# EAGLE design POWER_DISTRO (EAGLE 5.06)
SHT_NAME: POWER INPUT; VOLTAGE: 36V

## Sheet 1 of 4
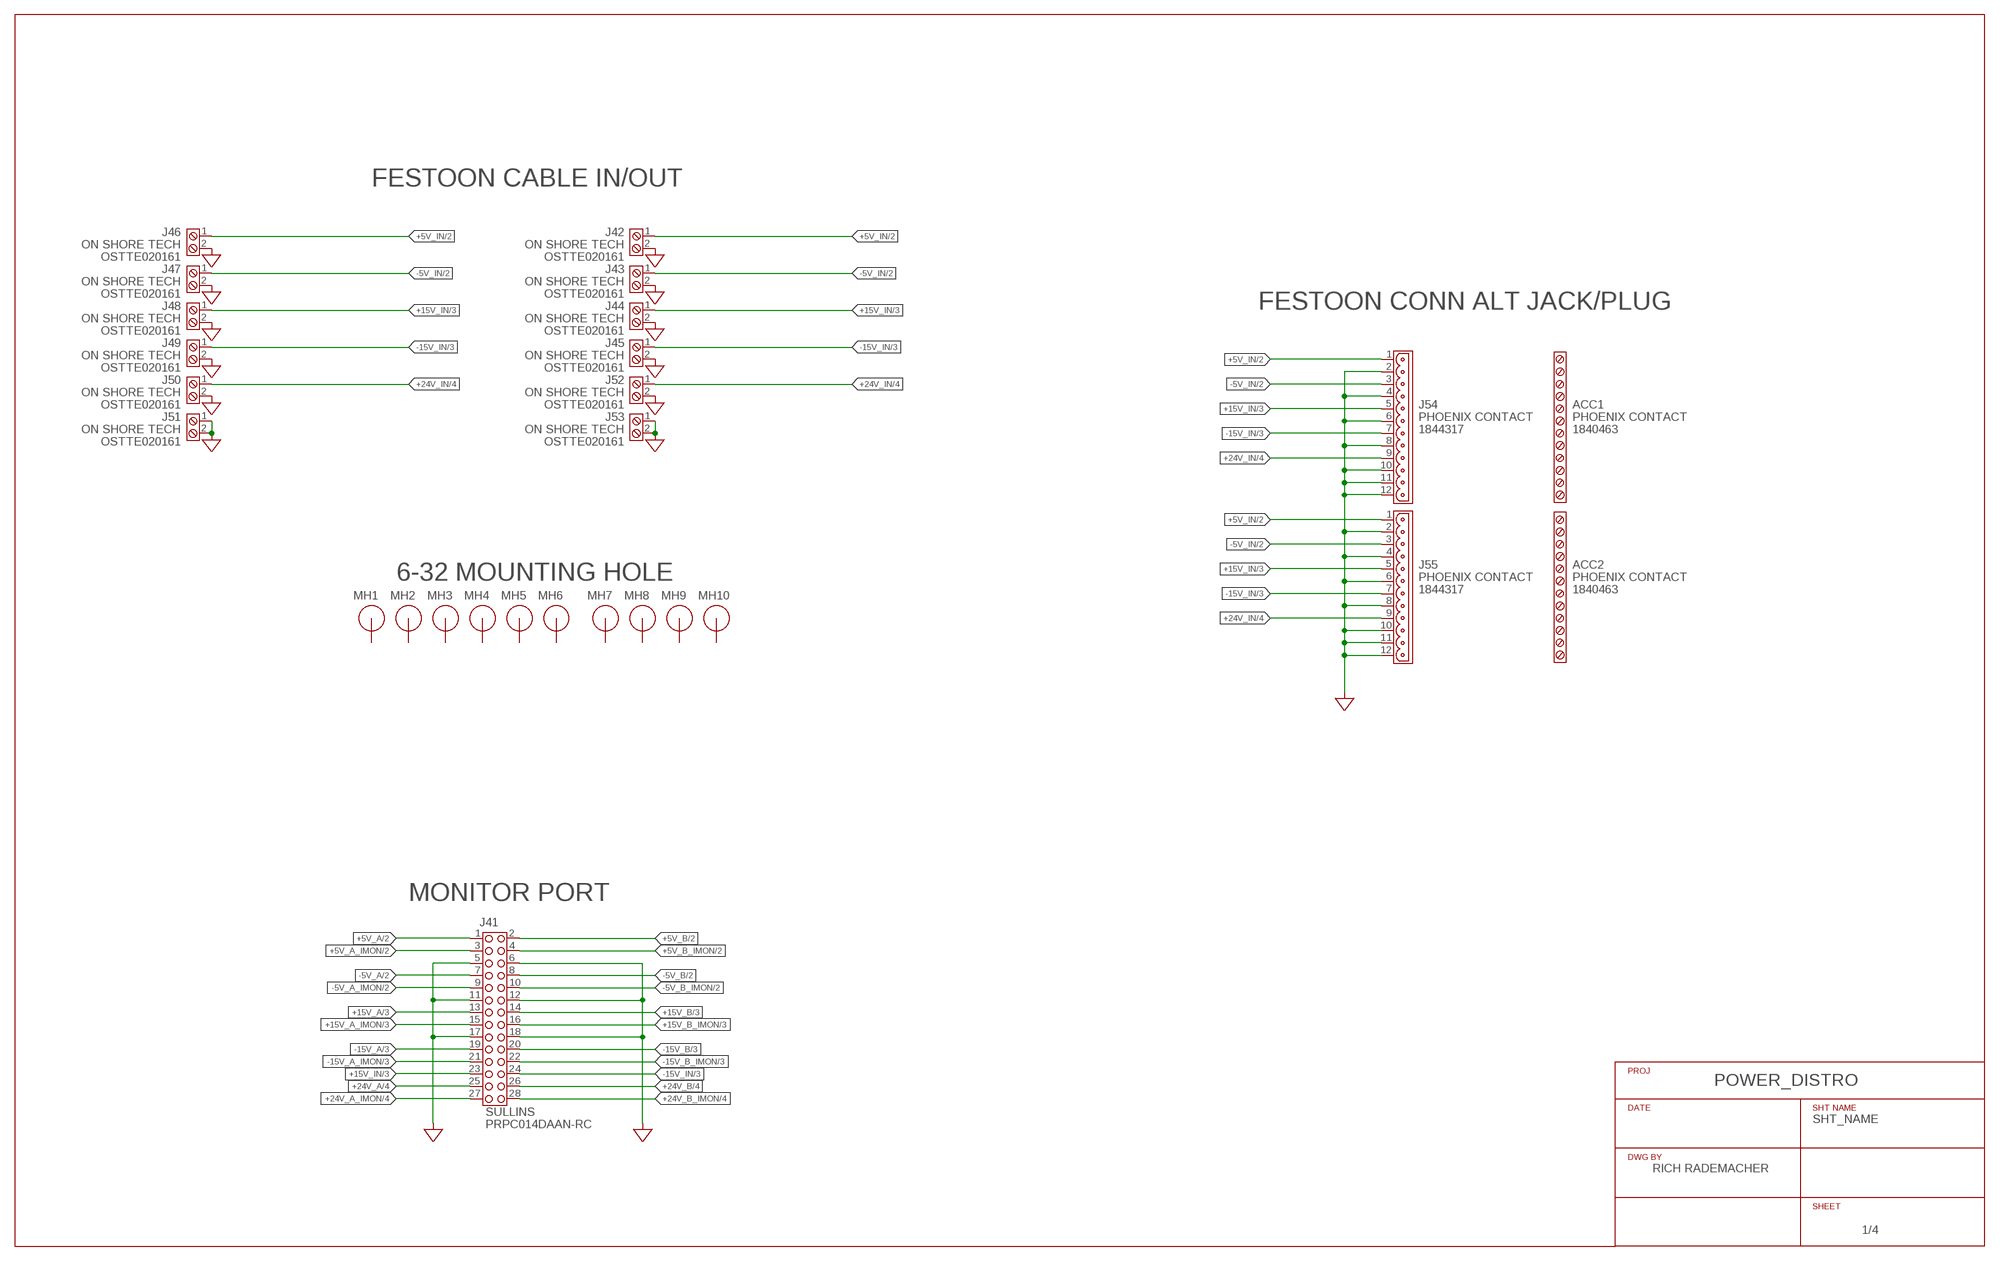
[diagram p0: schematic, sheet 1]
ACC1 (ACC_SCREWTERM_3.5_12POS_PLUG): MFG: PHOENIX CONTACT; MPN: 1840463; PRICE: 19.85; VENDOR: DIGIKEY; VPN: 277-5740-ND
ACC2 (ACC_SCREWTERM_3.5_12POS_PLUG): MFG: PHOENIX CONTACT; MPN: 1840463; PRICE: 19.85; VENDOR: DIGIKEY; VPN: 277-5740-ND
U$4 (TITLEBLOCK): AUTHOR: RICH RADEMACHER; DO_NOT_BOM: TRUE; SHT_NAME: SHT_NAME

### Parts
J41  HDR_2X14X100  [2X14X0.100_HDR]
J42  CONN_SCREWTERM_3.5MM_2POS  [OST_SCREWTERM_3.5MM_2POS]
J43  CONN_SCREWTERM_3.5MM_2POS  [OST_SCREWTERM_3.5MM_2POS]
J44  CONN_SCREWTERM_3.5MM_2POS  [OST_SCREWTERM_3.5MM_2POS]
J45  CONN_SCREWTERM_3.5MM_2POS  [OST_SCREWTERM_3.5MM_2POS]
J46  CONN_SCREWTERM_3.5MM_2POS  [OST_SCREWTERM_3.5MM_2POS]
J47  CONN_SCREWTERM_3.5MM_2POS  [OST_SCREWTERM_3.5MM_2POS]
J48  CONN_SCREWTERM_3.5MM_2POS  [OST_SCREWTERM_3.5MM_2POS]
J49  CONN_SCREWTERM_3.5MM_2POS  [OST_SCREWTERM_3.5MM_2POS]
J50  CONN_SCREWTERM_3.5MM_2POS  [OST_SCREWTERM_3.5MM_2POS]
J51  CONN_SCREWTERM_3.5MM_2POS  [OST_SCREWTERM_3.5MM_2POS]
J52  CONN_SCREWTERM_3.5MM_2POS  [OST_SCREWTERM_3.5MM_2POS]
J53  CONN_SCREWTERM_3.5MM_2POS  [OST_SCREWTERM_3.5MM_2POS]
J54  CONN_SCREWTERM_3.5MM_12POS_RECEPT  [PHOENIX_1844317]
J55  CONN_SCREWTERM_3.5MM_12POS_RECEPT  [PHOENIX_1844317]
MH1  MTG-HOLE-6-32  [MTG-6-32]
MH2  MTG-HOLE-6-32  [MTG-6-32]
MH3  MTG-HOLE-6-32  [MTG-6-32]
MH4  MTG-HOLE-6-32  [MTG-6-32]
MH5  MTG-HOLE-6-32  [MTG-6-32]
MH6  MTG-HOLE-6-32  [MTG-6-32]
MH7  MTG-HOLE-6-32  [MTG-6-32]
MH8  MTG-HOLE-6-32  [MTG-6-32]
MH9  MTG-HOLE-6-32  [MTG-6-32]
MH10  MTG-HOLE-6-32  [MTG-6-32]

### Nets
+5V_A: J41.1 ; also sheet 2
+5V_A_IMON: J41.3 ; also sheet 2
+5V_B: J41.2 ; also sheet 2
+5V_B_IMON: J41.4 ; also sheet 2
+5V_IN: J42.1 J46.1 J54.1 J55.1 ; also sheet 2
+15V_A: J41.13 ; also sheet 3
+15V_A_IMON: J41.15 ; also sheet 3
+15V_B: J41.14 ; also sheet 3
+15V_B_IMON: J41.16 ; also sheet 3
+15V_IN: J41.23 J44.1 J48.1 J54.5 J55.5 ; also sheet 3
+24V_A: J41.25 ; also sheet 4
+24V_A_IMON: J41.27 ; also sheet 4
+24V_B: J41.26 ; also sheet 4
+24V_B_IMON: J41.28 ; also sheet 4
+24V_IN: J50.1 J52.1 J54.9 J55.9 ; also sheet 4
-5V_A: J41.7 ; also sheet 2
-5V_A_IMON: J41.9 ; also sheet 2
-5V_B: J41.8 ; also sheet 2
-5V_B_IMON: J41.10 ; also sheet 2
-5V_IN: J43.1 J47.1 J54.3 J55.3 ; also sheet 2
-15V_A: J41.19 ; also sheet 3
-15V_A_IMON: J41.21 ; also sheet 3
-15V_B: J41.20 ; also sheet 3
-15V_B_IMON: J41.22 ; also sheet 3
-15V_IN: J41.24 J45.1 J49.1 J54.7 J55.7 ; also sheet 3
AGND: J41.5 J41.6 J41.11 J41.12 J41.17 J41.18 J42.2 J43.2 J44.2 J45.2 J46.2 J47.2 J48.2 J49.2 J50.2 J51.1 J51.2 J52.2 J53.1 J53.2 J54.2 J54.4 J54.6 J54.8 J54.10 J54.11 J54.12 J55.2 J55.4 J55.6 J55.8 J55.10 J55.11 J55.12 ; also sheet 2,3,4
Unconnected: MH1.1 MH2.1 MH3.1 MH4.1 MH5.1 MH6.1 MH7.1 MH8.1 MH9.1 MH10.1

### Notes on the sheet
- FESTOON CABLE IN/OUT
- FESTOON CONN ALT JACK/PLUG
- 6-32 MOUNTING HOLE
- MONITOR PORT

## Sheet 2 of 4
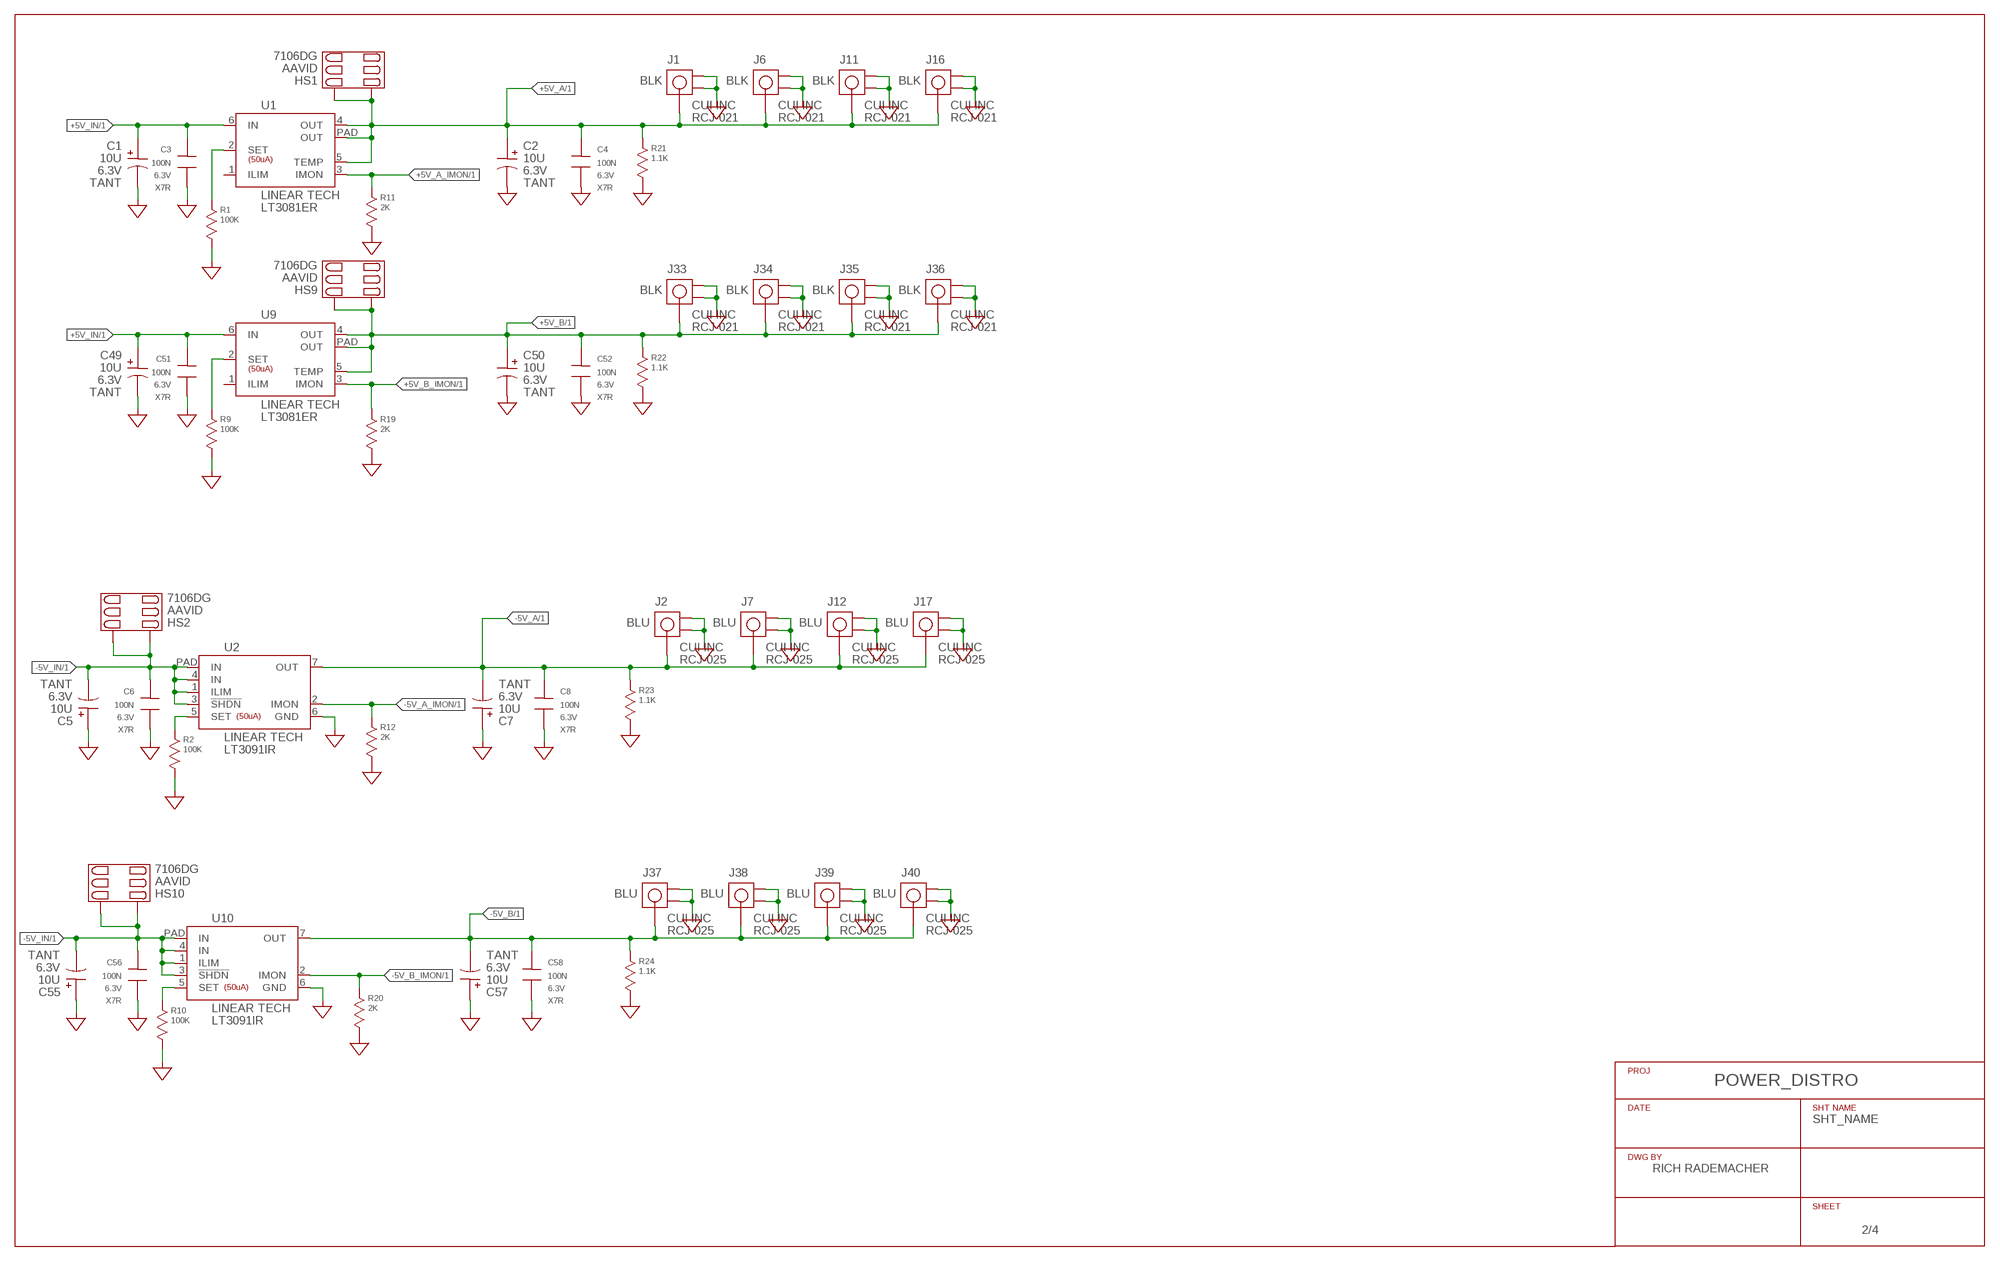
[diagram p1: schematic, sheet 2]
U$1 (TITLEBLOCK): AUTHOR: RICH RADEMACHER; DO_NOT_BOM: TRUE; SHT_NAME: SHT_NAME

### Parts
C1  10U  CAP-POL-SIZED  [CAP-SIZE_D/E_EIA7343]
C2  10U  CAP-POL-SIZED  [CAP-SIZE_D/E_EIA7343]
C3  100N  CAP-NP-0805  [R-0805]
C4  100N  CAP-NP-0805  [R-0805]
C5  10U  CAP-POL-SIZED  [CAP-SIZE_D/E_EIA7343]
C6  100N  CAP-NP-0805  [R-0805]
C7  10U  CAP-POL-SIZED  [CAP-SIZE_D/E_EIA7343]
C8  100N  CAP-NP-0805  [R-0805]
C49  10U  CAP-POL-SIZED  [CAP-SIZE_D/E_EIA7343]
C50  10U  CAP-POL-SIZED  [CAP-SIZE_D/E_EIA7343]
C51  100N  CAP-NP-0805  [R-0805]
C52  100N  CAP-NP-0805  [R-0805]
C55  10U  CAP-POL-SIZED  [CAP-SIZE_D/E_EIA7343]
C56  100N  CAP-NP-0805  [R-0805]
C57  10U  CAP-POL-SIZED  [CAP-SIZE_D/E_EIA7343]
C58  100N  CAP-NP-0805  [R-0805]
HS1  HEATSINK_AAVID_7106  [AAVID_7106]
HS2  HEATSINK_AAVID_7106  [AAVID_7106]
HS9  HEATSINK_AAVID_7106  [AAVID_7106]
HS10  HEATSINK_AAVID_7106  [AAVID_7106]
J1  CONN_RCA  CONN_RCA-BLACK-BLK  [CUI_RCJ-02X]
J2  CONN_RCA  CONN_RCA-BLU-BLK  [CUI_RCJ-02X]
J6  CONN_RCA  CONN_RCA-BLACK-BLK  [CUI_RCJ-02X]
J7  CONN_RCA  CONN_RCA-BLU-BLK  [CUI_RCJ-02X]
J11  CONN_RCA  CONN_RCA-BLACK-BLK  [CUI_RCJ-02X]
J12  CONN_RCA  CONN_RCA-BLU-BLK  [CUI_RCJ-02X]
J16  CONN_RCA  CONN_RCA-BLACK-BLK  [CUI_RCJ-02X]
J17  CONN_RCA  CONN_RCA-BLU-BLK  [CUI_RCJ-02X]
J33  CONN_RCA  CONN_RCA-BLACK-BLK  [CUI_RCJ-02X]
J34  CONN_RCA  CONN_RCA-BLACK-BLK  [CUI_RCJ-02X]
J35  CONN_RCA  CONN_RCA-BLACK-BLK  [CUI_RCJ-02X]
J36  CONN_RCA  CONN_RCA-BLACK-BLK  [CUI_RCJ-02X]
J37  CONN_RCA  CONN_RCA-BLU-BLK  [CUI_RCJ-02X]
J38  CONN_RCA  CONN_RCA-BLU-BLK  [CUI_RCJ-02X]
J39  CONN_RCA  CONN_RCA-BLU-BLK  [CUI_RCJ-02X]
J40  CONN_RCA  CONN_RCA-BLU-BLK  [CUI_RCJ-02X]
R1  100K  RESISTOR-0805  [R-0805]
R2  100K  RESISTOR-0805  [R-0805]
R9  100K  RESISTOR-0805  [R-0805]
R10  100K  RESISTOR-0805  [R-0805]
R11  2K  RESISTOR-0805  [R-0805]
R12  2K  RESISTOR-0805  [R-0805]
R19  2K  RESISTOR-0805  [R-0805]
R20  2K  RESISTOR-0805  [R-0805]
R21  1.1K  RESISTOR-0805  [R-0805]
R22  1.1K  RESISTOR-0805  [R-0805]
R23  1.1K  RESISTOR-0805  [R-0805]
R24  1.1K  RESISTOR-0805  [R-0805]
U1  REG_LT3081  [DD-7_LINEARTECH]
U2  REG_LT3091  [DD-7_LINEARTECH]
U9  REG_LT3081  [DD-7_LINEARTECH]
U10  REG_LT3091  [DD-7_LINEARTECH]

### Nets
+5V_A: C2.+ C4.A HS1.L HS1.R J1.PIN J6.PIN J11.PIN J16.PIN R21.A U1.4(OUT) U1.5(TEMP) U1.PAD(OUT) ; also sheet 1
+5V_A_IMON: R11.A U1.3(IMON) ; also sheet 1
+5V_B: C50.+ C52.A HS9.L HS9.R J33.PIN J34.PIN J35.PIN J36.PIN R22.A U9.4(OUT) U9.5(TEMP) U9.PAD(OUT) ; also sheet 1
+5V_B_IMON: R19.A U9.3(IMON) ; also sheet 1
+5V_IN: C1.+ C3.A C49.+ C51.A U1.6(IN) U9.6(IN) ; also sheet 1
-5V_A: C7.- C8.A J2.PIN J7.PIN J12.PIN J17.PIN R23.A U2.7(OUT) ; also sheet 1
-5V_A_IMON: R12.A U2.2(IMON) ; also sheet 1
-5V_B: C57.- C58.A J37.PIN J38.PIN J39.PIN J40.PIN R24.A U10.7(OUT) ; also sheet 1
-5V_B_IMON: R20.A U10.2(IMON) ; also sheet 1
-5V_IN: C5.- C6.A C55.- C56.A HS2.L HS2.R HS10.L HS10.R U2.1(ILIM) U2.3(!SHDN) U2.4(IN) U2.PAD(IN) U10.1(ILIM) U10.3(!SHDN) U10.4(IN) U10.PAD(IN) ; also sheet 1
AGND: C1.- C2.- C3.B C4.B C5.+ C6.B C7.+ C8.B C49.- C50.- C51.B C52.B C55.+ C56.B C57.+ C58.B J1.GND@1 J1.GND@2 J2.GND@1 J2.GND@2 J6.GND@1 J6.GND@2 J7.GND@1 J7.GND@2 J11.GND@1 J11.GND@2 J12.GND@1 J12.GND@2 J16.GND@1 J16.GND@2 J17.GND@1 J17.GND@2 J33.GND@1 J33.GND@2 J34.GND@1 J34.GND@2 J35.GND@1 J35.GND@2 J36.GND@1 J36.GND@2 J37.GND@1 J37.GND@2 J38.GND@1 J38.GND@2 J39.GND@1 J39.GND@2 J40.GND@1 J40.GND@2 R1.B R2.B R9.B R10.B R11.B R12.B R19.B R20.B R21.B R22.B R23.B R24.B U2.6(GND) U10.6(GND) ; also sheet 1,3,4
N$1: R1.A U1.2(SET)
N$2: R2.A U2.5(SET)
N$10: R9.A U9.2(SET)
N$19: R10.A U10.5(SET)
Unconnected: U1.1(ILIM) U9.1(ILIM)

## Sheet 3 of 4
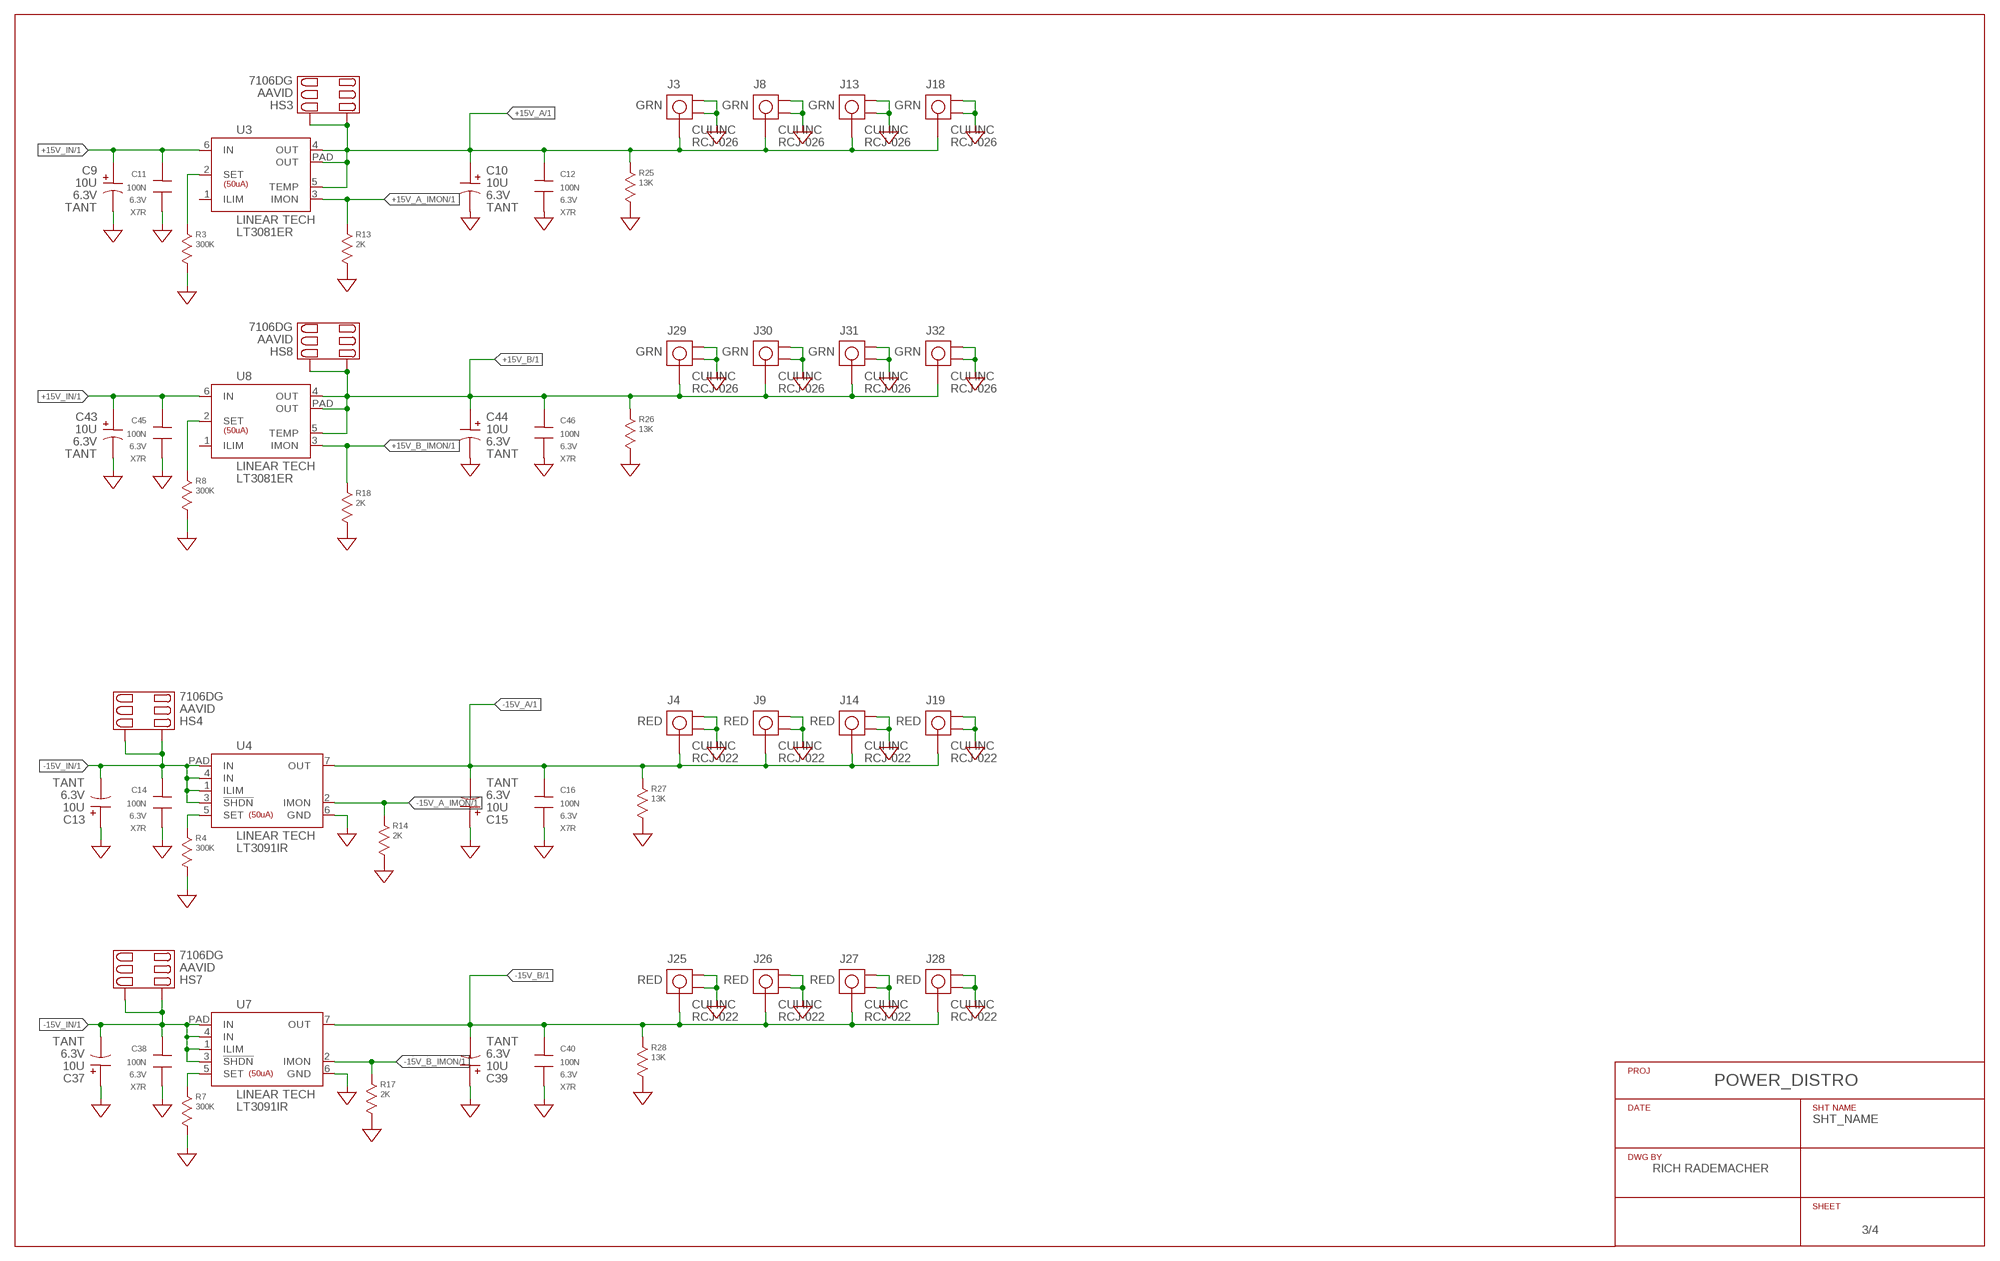
[diagram p2: schematic, sheet 3]
U$2 (TITLEBLOCK): AUTHOR: RICH RADEMACHER; DO_NOT_BOM: TRUE; SHT_NAME: SHT_NAME

### Parts
C9  10U  CAP-POL-SIZED  [CAP-SIZE_D/E_EIA7343]
C10  10U  CAP-POL-SIZED  [CAP-SIZE_D/E_EIA7343]
C11  100N  CAP-NP-0805  [R-0805]
C12  100N  CAP-NP-0805  [R-0805]
C13  10U  CAP-POL-SIZED  [CAP-SIZE_D/E_EIA7343]
C14  100N  CAP-NP-0805  [R-0805]
C15  10U  CAP-POL-SIZED  [CAP-SIZE_D/E_EIA7343]
C16  100N  CAP-NP-0805  [R-0805]
C37  10U  CAP-POL-SIZED  [CAP-SIZE_D/E_EIA7343]
C38  100N  CAP-NP-0805  [R-0805]
C39  10U  CAP-POL-SIZED  [CAP-SIZE_D/E_EIA7343]
C40  100N  CAP-NP-0805  [R-0805]
C43  10U  CAP-POL-SIZED  [CAP-SIZE_D/E_EIA7343]
C44  10U  CAP-POL-SIZED  [CAP-SIZE_D/E_EIA7343]
C45  100N  CAP-NP-0805  [R-0805]
C46  100N  CAP-NP-0805  [R-0805]
HS3  HEATSINK_AAVID_7106  [AAVID_7106]
HS4  HEATSINK_AAVID_7106  [AAVID_7106]
HS7  HEATSINK_AAVID_7106  [AAVID_7106]
HS8  HEATSINK_AAVID_7106  [AAVID_7106]
J3  CONN_RCA  CONN_RCA-GRN-BLK  [CUI_RCJ-02X]
J4  CONN_RCA  CONN_RCA-RED-BLK  [CUI_RCJ-02X]
J8  CONN_RCA  CONN_RCA-GRN-BLK  [CUI_RCJ-02X]
J9  CONN_RCA  CONN_RCA-RED-BLK  [CUI_RCJ-02X]
J13  CONN_RCA  CONN_RCA-GRN-BLK  [CUI_RCJ-02X]
J14  CONN_RCA  CONN_RCA-RED-BLK  [CUI_RCJ-02X]
J18  CONN_RCA  CONN_RCA-GRN-BLK  [CUI_RCJ-02X]
J19  CONN_RCA  CONN_RCA-RED-BLK  [CUI_RCJ-02X]
J25  CONN_RCA  CONN_RCA-RED-BLK  [CUI_RCJ-02X]
J26  CONN_RCA  CONN_RCA-RED-BLK  [CUI_RCJ-02X]
J27  CONN_RCA  CONN_RCA-RED-BLK  [CUI_RCJ-02X]
J28  CONN_RCA  CONN_RCA-RED-BLK  [CUI_RCJ-02X]
J29  CONN_RCA  CONN_RCA-GRN-BLK  [CUI_RCJ-02X]
J30  CONN_RCA  CONN_RCA-GRN-BLK  [CUI_RCJ-02X]
J31  CONN_RCA  CONN_RCA-GRN-BLK  [CUI_RCJ-02X]
J32  CONN_RCA  CONN_RCA-GRN-BLK  [CUI_RCJ-02X]
R3  300K  RESISTOR-0805  [R-0805]
R4  300K  RESISTOR-0805  [R-0805]
R7  300K  RESISTOR-0805  [R-0805]
R8  300K  RESISTOR-0805  [R-0805]
R13  2K  RESISTOR-0805  [R-0805]
R14  2K  RESISTOR-0805  [R-0805]
R17  2K  RESISTOR-0805  [R-0805]
R18  2K  RESISTOR-0805  [R-0805]
R25  13K  RESISTOR-0805  [R-0805]
R26  13K  RESISTOR-0805  [R-0805]
R27  13K  RESISTOR-0805  [R-0805]
R28  13K  RESISTOR-0805  [R-0805]
U3  REG_LT3081  [DD-7_LINEARTECH]
U4  REG_LT3091  [DD-7_LINEARTECH]
U7  REG_LT3091  [DD-7_LINEARTECH]
U8  REG_LT3081  [DD-7_LINEARTECH]

### Nets
+15V_A: C10.+ C12.A HS3.L HS3.R J3.PIN J8.PIN J13.PIN J18.PIN R25.A U3.4(OUT) U3.5(TEMP) U3.PAD(OUT) ; also sheet 1
+15V_A_IMON: R13.A U3.3(IMON) ; also sheet 1
+15V_B: C44.+ C46.A HS8.L HS8.R J29.PIN J30.PIN J31.PIN J32.PIN R26.A U8.4(OUT) U8.5(TEMP) U8.PAD(OUT) ; also sheet 1
+15V_B_IMON: R18.A U8.3(IMON) ; also sheet 1
+15V_IN: C9.+ C11.A C43.+ C45.A U3.6(IN) U8.6(IN) ; also sheet 1
-15V_A: C15.- C16.A J4.PIN J9.PIN J14.PIN J19.PIN R27.A U4.7(OUT) ; also sheet 1
-15V_A_IMON: R14.A U4.2(IMON) ; also sheet 1
-15V_B: C39.- C40.A J25.PIN J26.PIN J27.PIN J28.PIN R28.A U7.7(OUT) ; also sheet 1
-15V_B_IMON: R17.A U7.2(IMON) ; also sheet 1
-15V_IN: C13.- C14.A C37.- C38.A HS4.L HS4.R HS7.L HS7.R U4.1(ILIM) U4.3(!SHDN) U4.4(IN) U4.PAD(IN) U7.1(ILIM) U7.3(!SHDN) U7.4(IN) U7.PAD(IN) ; also sheet 1
AGND: C9.- C10.- C11.B C12.B C13.+ C14.B C15.+ C16.B C37.+ C38.B C39.+ C40.B C43.- C44.- C45.B C46.B J3.GND@1 J3.GND@2 J4.GND@1 J4.GND@2 J8.GND@1 J8.GND@2 J9.GND@1 J9.GND@2 J13.GND@1 J13.GND@2 J14.GND@1 J14.GND@2 J18.GND@1 J18.GND@2 J19.GND@1 J19.GND@2 J25.GND@1 J25.GND@2 J26.GND@1 J26.GND@2 J27.GND@1 J27.GND@2 J28.GND@1 J28.GND@2 J29.GND@1 J29.GND@2 J30.GND@1 J30.GND@2 J31.GND@1 J31.GND@2 J32.GND@1 J32.GND@2 R3.B R4.B R7.B R8.B R13.B R14.B R17.B R18.B R25.B R26.B R27.B R28.B U4.6(GND) U7.6(GND) ; also sheet 1,2,4
N$3: R3.A U3.2(SET)
N$4: R4.A U4.5(SET)
N$14: R7.A U7.5(SET)
N$16: R8.A U8.2(SET)
Unconnected: U3.1(ILIM) U8.1(ILIM)

## Sheet 4 of 4
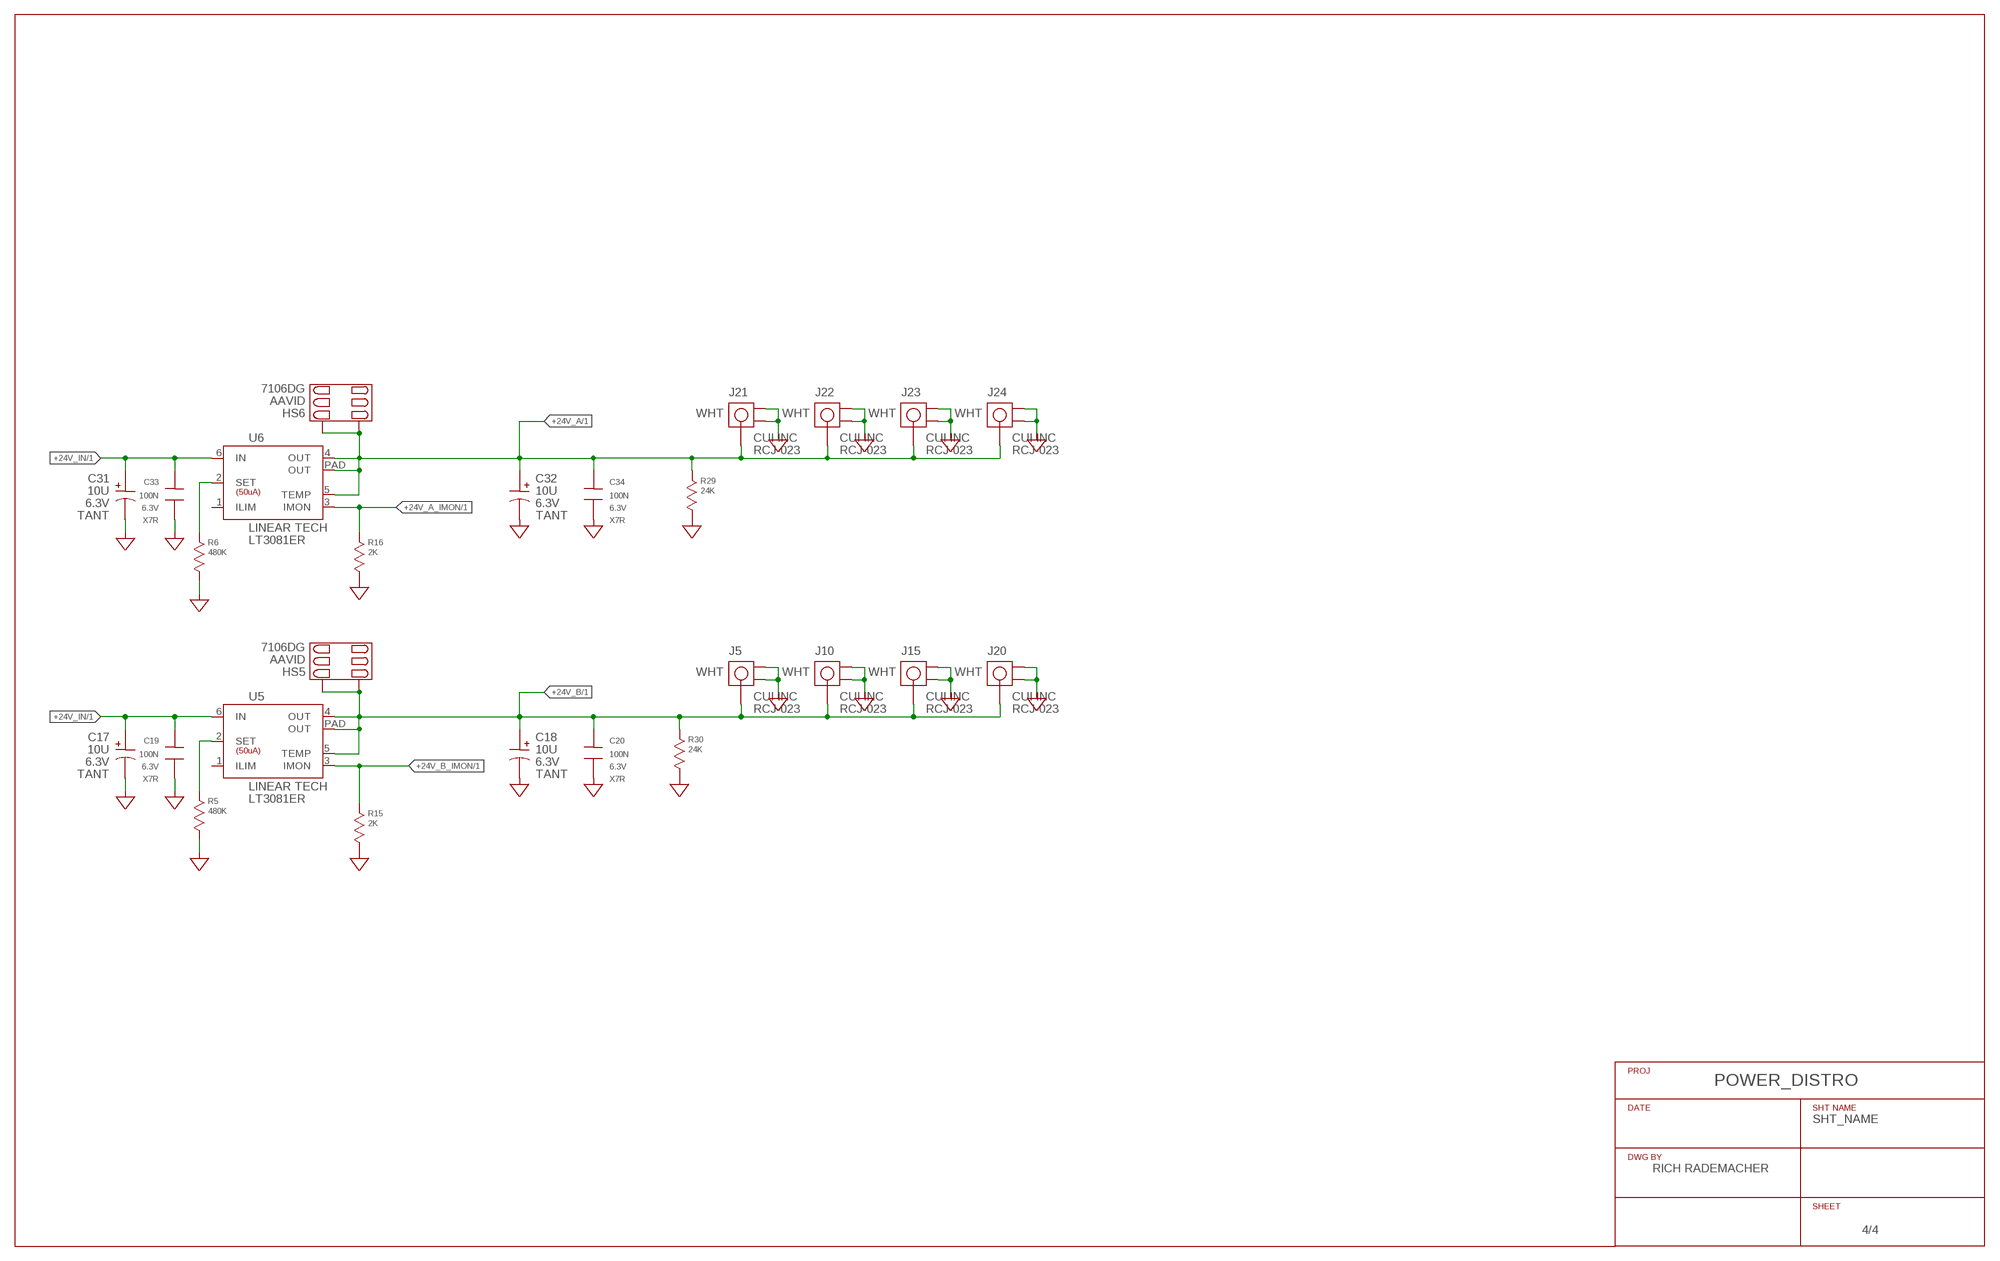
[diagram p3: schematic, sheet 4]
U$3 (TITLEBLOCK): AUTHOR: RICH RADEMACHER; DO_NOT_BOM: TRUE; SHT_NAME: SHT_NAME

### Parts
C17  10U  CAP-POL-SIZED  [CAP-SIZE_D/E_EIA7343]
C18  10U  CAP-POL-SIZED  [CAP-SIZE_D/E_EIA7343]
C19  100N  CAP-NP-0805  [R-0805]
C20  100N  CAP-NP-0805  [R-0805]
C31  10U  CAP-POL-SIZED  [CAP-SIZE_D/E_EIA7343]
C32  10U  CAP-POL-SIZED  [CAP-SIZE_D/E_EIA7343]
C33  100N  CAP-NP-0805  [R-0805]
C34  100N  CAP-NP-0805  [R-0805]
HS5  HEATSINK_AAVID_7106  [AAVID_7106]
HS6  HEATSINK_AAVID_7106  [AAVID_7106]
J5  CONN_RCA  CONN_RCA-WHT-BLK  [CUI_RCJ-02X]
J10  CONN_RCA  CONN_RCA-WHT-BLK  [CUI_RCJ-02X]
J15  CONN_RCA  CONN_RCA-WHT-BLK  [CUI_RCJ-02X]
J20  CONN_RCA  CONN_RCA-WHT-BLK  [CUI_RCJ-02X]
J21  CONN_RCA  CONN_RCA-WHT-BLK  [CUI_RCJ-02X]
J22  CONN_RCA  CONN_RCA-WHT-BLK  [CUI_RCJ-02X]
J23  CONN_RCA  CONN_RCA-WHT-BLK  [CUI_RCJ-02X]
J24  CONN_RCA  CONN_RCA-WHT-BLK  [CUI_RCJ-02X]
R5  480K  RESISTOR-0805  [R-0805]
R6  480K  RESISTOR-0805  [R-0805]
R15  2K  RESISTOR-0805  [R-0805]
R16  2K  RESISTOR-0805  [R-0805]
R29  24K  RESISTOR-0805  [R-0805]
R30  24K  RESISTOR-0805  [R-0805]
U5  REG_LT3081  [DD-7_LINEARTECH]
U6  REG_LT3081  [DD-7_LINEARTECH]

### Nets
+24V_A: C32.+ C34.A HS6.L HS6.R J21.PIN J22.PIN J23.PIN J24.PIN R29.A U6.4(OUT) U6.5(TEMP) U6.PAD(OUT) ; also sheet 1
+24V_A_IMON: R16.A U6.3(IMON) ; also sheet 1
+24V_B: C18.+ C20.A HS5.L HS5.R J5.PIN J10.PIN J15.PIN J20.PIN R30.A U5.4(OUT) U5.5(TEMP) U5.PAD(OUT) ; also sheet 1
+24V_B_IMON: R15.A U5.3(IMON) ; also sheet 1
+24V_IN: C17.+ C19.A C31.+ C33.A U5.6(IN) U6.6(IN) ; also sheet 1
AGND: C17.- C18.- C19.B C20.B C31.- C32.- C33.B C34.B J5.GND@1 J5.GND@2 J10.GND@1 J10.GND@2 J15.GND@1 J15.GND@2 J20.GND@1 J20.GND@2 J21.GND@1 J21.GND@2 J22.GND@1 J22.GND@2 J23.GND@1 J23.GND@2 J24.GND@1 J24.GND@2 R5.B R6.B R15.B R16.B R29.B R30.B ; also sheet 1,2,3
N$5: R5.A U5.2(SET)
N$11: R6.A U6.2(SET)
Unconnected: U5.1(ILIM) U6.1(ILIM)

## Library data of the parts
C1 C2 C5 C7 C9 C10 C13 C15 C17 C18 C31 C32 C37 C39 C43 C44 C49 C50 C55 C57 = power_distro:CAP-POL; COST: 1.50; DIELECTRIC: TANT; MFG: AVX; MPN: TAJD-SERIES; SOLIDMODEL: CAP_TANT_SIZE_D.G; SOLIDWORKS_CONFIG: SIZE_E; SOLIDWORKS_FILE: TantalumCap.SLDASM; VENDOR: DIGIKEY; VOLTAGE: 6.3V
C3 C4 C6 C8 C11 C12 C14 C16 C19 C20 C33 C34 C38 C40 C45 C46 C51 C52 C56 C58 = power_distro:CAP-NP; COST: .074; DIELECTRIC: X7R; SOLIDMODEL: CAP_NP_0805.g; SOLIDWORKS_CONFIG: SIZE_0805; SOLIDWORKS_FILE: ChipCapacitor.SLDASM; VOLTAGE: 6.3V
HS1-HS10 = power_distro:HEATSINK_AAVID_7106: 7106 Surface mount heat sink for D2 PAK (TO-263), power SO-10 (MO-184) and SO-10 package semiconductors; MFG: AAVID; MPN: 7106DG; PRICE: 1.44; SOLIDWORKS_CONFIG: Default; SOLIDWORKS_FILE: AAVID_7106.SLDPRT; VENDOR: DIGIKEY; VPN: HS412-ND
J1 J6 J11 J16 J33-J36 = power_distro:CONN_RCA: VERTICAL THROUGH HOLE RCA JACK FEMALE; COLOR: BLK; MFG: CUI INC; MPN: RCJ-021; PRICE: 0.88; SOLIDWORKS_CONFIG: Default; SOLIDWORKS_FILE: rcj-021.SLDASM; VENDOR: DIGIKEY; VPN: CP-1406-ND
J2 J7 J12 J17 J37-J40 = power_distro:CONN_RCA: VERTICAL THROUGH HOLE RCA JACK FEMALE; COLOR: BLU; MFG: CUI INC; MPN: RCJ-025; PRICE: 0.88; SOLIDWORKS_CONFIG: Default; SOLIDWORKS_FILE: rcj-021.SLDASM; VENDOR: DIGIKEY; VPN: CP-1410-ND
J3 J8 J13 J18 J29-J32 = power_distro:CONN_RCA: VERTICAL THROUGH HOLE RCA JACK FEMALE; COLOR: GRN; MFG: CUI INC; MPN: RCJ-026; PRICE: 0.88; SOLIDWORKS_CONFIG: Default; SOLIDWORKS_FILE: rcj-021.SLDASM; VENDOR: DIGIKEY; VPN: CP-1411-ND
J4 J9 J14 J19 J25-J28 = power_distro:CONN_RCA: VERTICAL THROUGH HOLE RCA JACK FEMALE; COLOR: RED; MFG: CUI INC; MPN: RCJ-022; PRICE: 0.88; SOLIDWORKS_CONFIG: Default; SOLIDWORKS_FILE: rcj-021.SLDASM; VENDOR: DIGIKEY; VPN: CP-1407-ND
J5 J10 J15 J20-J24 = power_distro:CONN_RCA: VERTICAL THROUGH HOLE RCA JACK FEMALE; COLOR: WHT; MFG: CUI INC; MPN: RCJ-023; PRICE: 0.88; SOLIDWORKS_CONFIG: Default; SOLIDWORKS_FILE: rcj-021.SLDASM; VENDOR: DIGIKEY; VPN: CP-1408-ND
J41 = power_distro:HDR_2X14X100: 2 X 14 X 0.1" HEADER; MFG: SULLINS; MPN: PRPC014DAAN-RC; PRICE: 1.00; SOLIDWORKS_CONFIGURATION: 2x14x0.100x0.230; SOLIDWORKS_FILE: Header_Unshrouded.SLDASM; VENDOR: DIGIKEY; VPN: S2011EC-14-ND
J42-J53 = power_distro:CONN_SCREWTERM_3.5MM_2POS: TERM BLOCK 3.5MM VERT 2POS PCB; MFG: ON SHORE TECH; MPN: OSTTE020161; PRICE: 0.92; SOLIDWORKS_CONFIG: Default; SOLIDWORKS_FILE: ScrewTerminal_OST_3.5mm.SLDASM; VENDOR: DIGIKEY; VPN: ED2635-ND
J54 J55 = power_distro:CONN_SCREWTERM_3.5MM_12POS_RECEPT: TERM BLOCK HDR 12POS 90DEG 3.5MM; MFG: PHOENIX CONTACT; MPN: 1844317; PRICE: 7.04; VENDOR: DIGIKEY; VPN: 277-5902-ND
MH1-MH10 = power_distro:MTG-HOLE; DO_NOT_BOM: TRUE
R1-R30 = power_distro:RESISTOR; PACKAGE: 0805; PRICE: .059; SOLIDMODEL: res0805.g; SOLIDWORKS_CONFIG: SIZE_0805; SOLIDWORKS_FILE: ChipResistor.SLDASM; TOLERANCE: 1%
U1 U3 U5 U6 U8 U9 = power_distro:REG_LT3081: 1.5A Single Resistor Rugged Linear Regulator with Monitors Extended Safe Operating Area Maximum Output Current: 1.5A Stable with or without Input/Output Capacitors Wide Input Voltage Range: 1.2V to 36V Single Resistor Sets Output Voltage Output Current Monitor: IMON = IOUT/5000 Junction Temperature Monitor: 1µA/°C Output Adjustable to 0V 50µA SET Pin Current: 1% Initial Accuracy Output Voltage Noise: 27µVRMS Parallel Multiple Devices for Higher Current or Heat Spreading Programmable Current Limit Reverse-Battery and Reverse-Current Protection <1mV Load Regulation Typical Independent of VOUT <0.001%/V Line Regulation Typical Available in Thermally-Enhanced 12-Lead 4mm × 4mm DFN and 16-Lead TSSOP, 7-Lead DD-Pak and 7-Lead TO-220; MFG: LINEAR TECH; MPN: LT3081ER; PRICE: 6.25; SOLIDWORKS_CONFIG: Default; SOLIDWORKS_FILE: D2PAK_7pin.SLDASM; VENDOR: DIGIKEY; VPN: LT3081ER#PBF-ND
U2 U4 U7 U10 = power_distro:REG_LT3091: ?36V, 1.5A Negative Linear Regulator with Programmable Current Limit Output Current: 1.5A Single Resistor Sets Output Voltage 50µA SET Pin Current: ±1% Initial Accuracy Programmable Current Limit Positive or Negative Output Current Monitor Parallelable for Higher Current and Heat Spreading Low Dropout Voltage: 300mV Low Output Noise: 18µVRMS (10Hz to 100kHz) Configurable as a 3-Terminal Floating Regulator Wide Input Voltage Range: ?1.5V to ?36V Rail-to-Rail Output Voltage Range: 0V to ?32V Positive/Negative Shutdown Logic or UVLO Programmable Cable Drop Compensation Load Regulation: 1.2mV (1mA to 1.5A) Stable with 10µF Minimum Output Capacitor Stable with Ceramic or Tantalum Capacitors Thermally Enhanced 14-Lead 4mm × 3mm DFN, 16-Lead TSSOP, 7-Lead TO-220 and DD Packages; MFG: LINEAR TECH; MPN: LT3091IR; PRICE: 8.12; SOLIDWORKS_CONFIG: Default; SOLIDWORKS_FILE: D2PAK_7pin.SLDASM; VENDOR: DIGIKEY; VPN: LT3091IR#PBF-ND

## Board
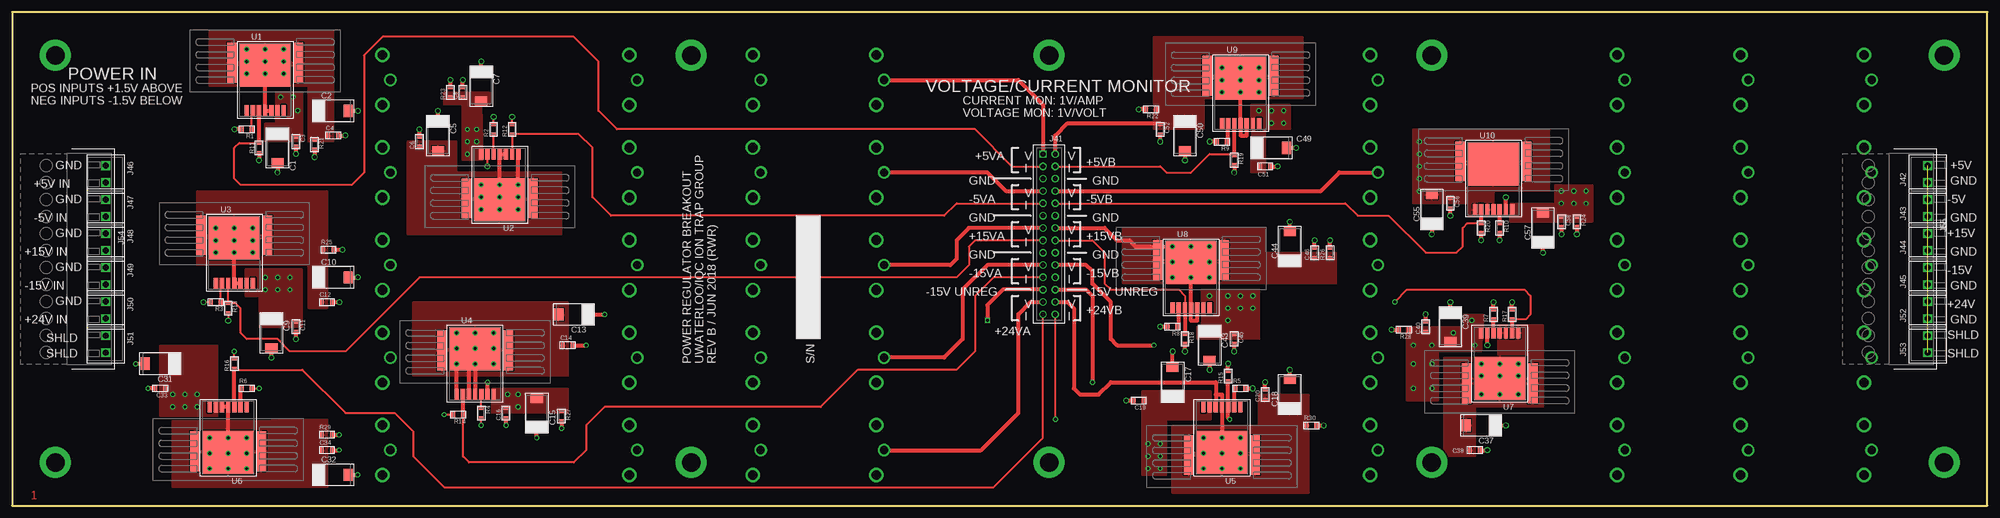
[diagram p4: board, top side]
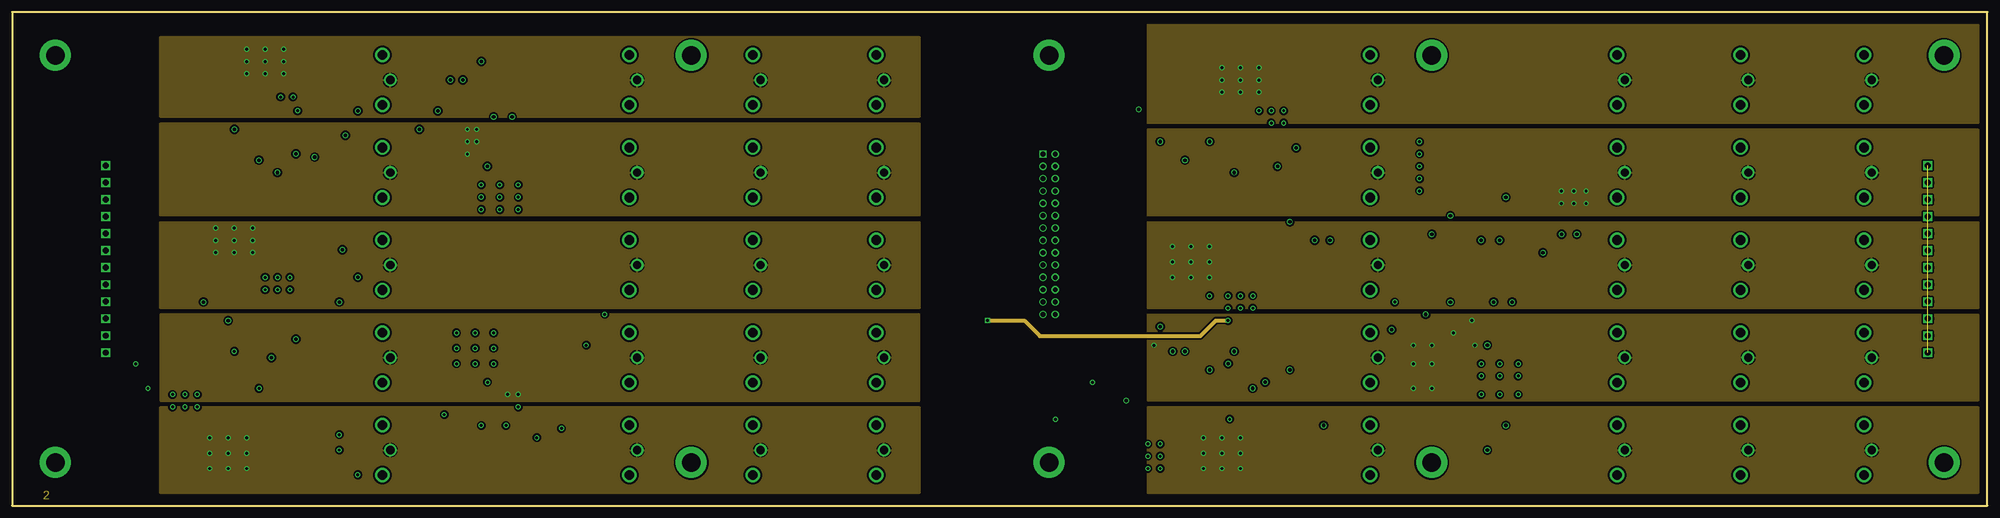
[diagram p5: board, inner layer Route2]
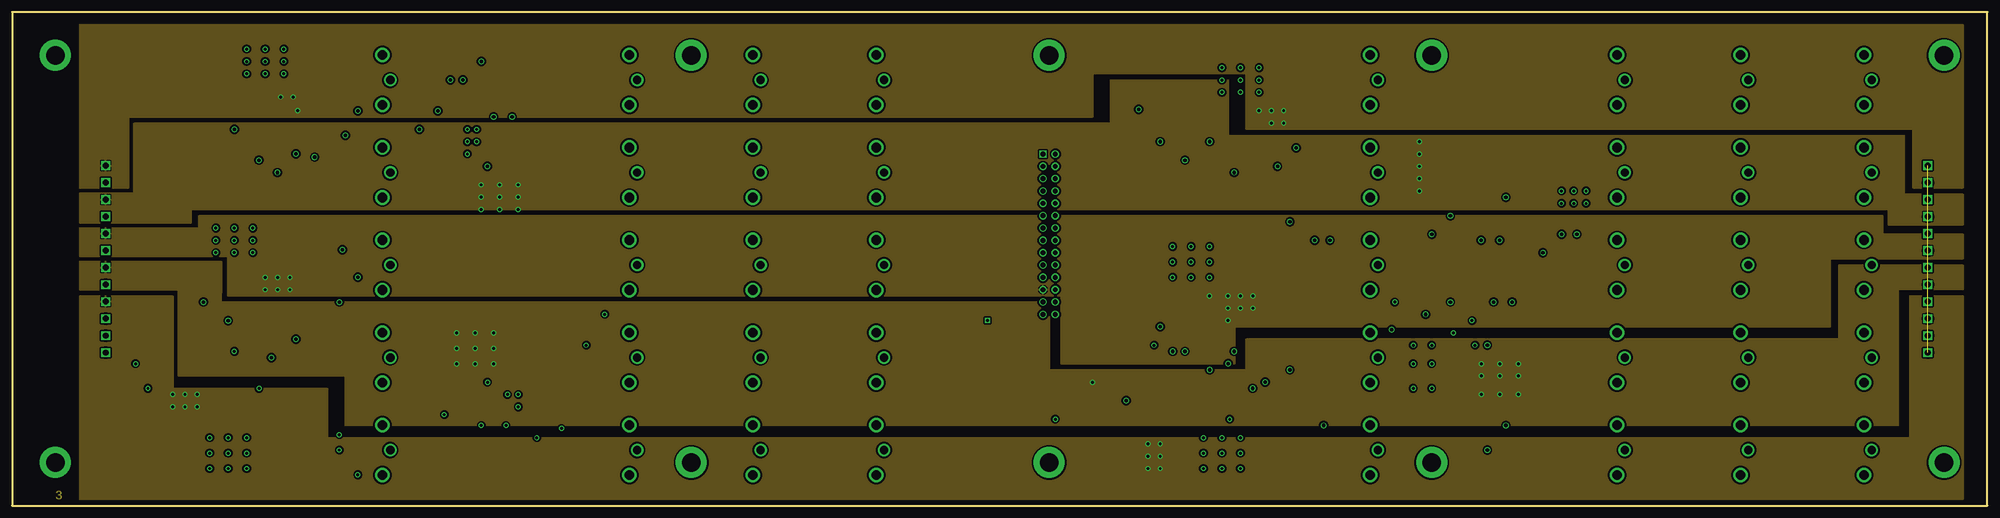
[diagram p6: board, inner layer Route15]
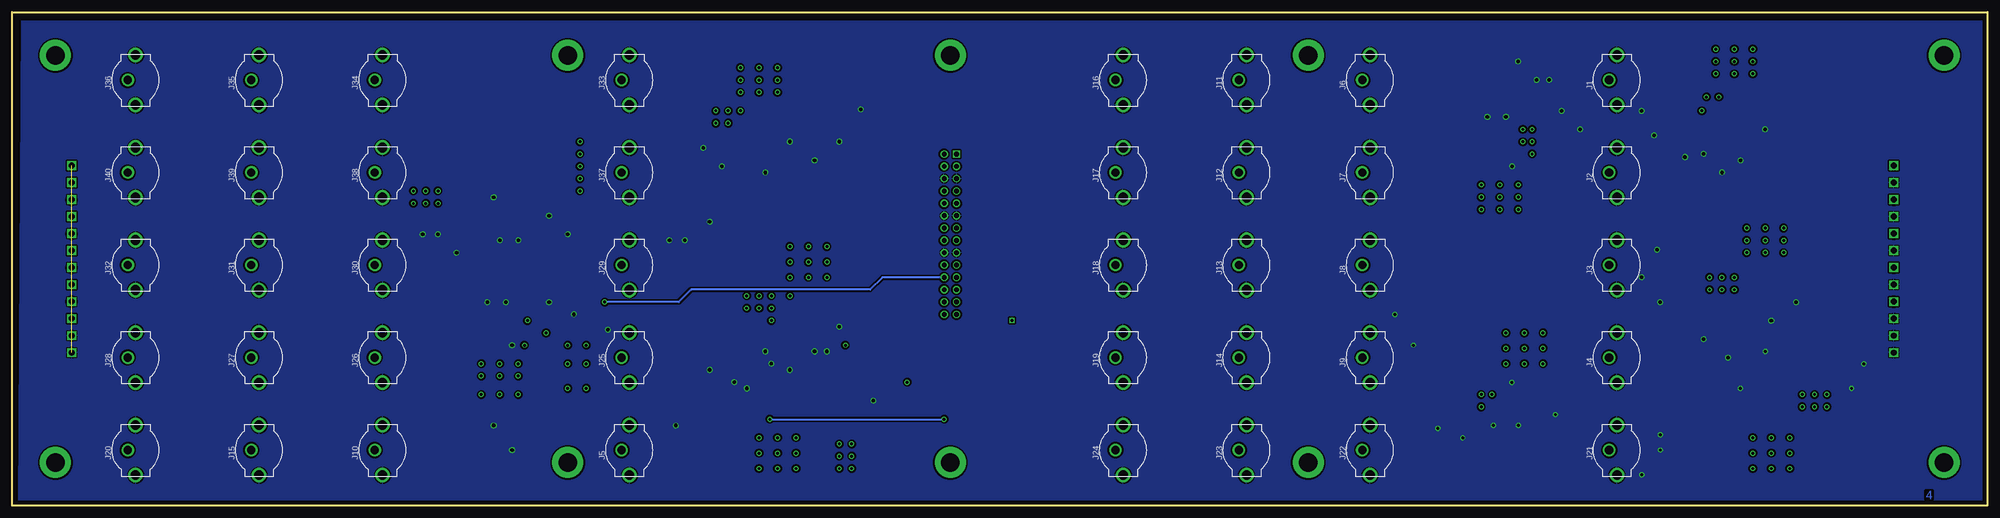
[diagram p7: board, bottom side, seen from below]

Size 406.4 x 101.6 mm. Coordinates in mm from the lower left corner, seen from the top.
Outline: 0,0 406.4,0 406.4,101.6 0,101.6 0,0
Copper layers (1*2+15*16): Top 0.035mm / dielectric 1.5mm / Route2 0.035mm / dielectric 0.15mm / Route15 0.035mm / dielectric 0.2mm / Bottom 0.035mm
Design rules "default *": minimum track width 10mil, minimum drill 10mil, track to track 15mil, track to pad 15mil, pad to pad 15mil, via to via 15mil, smd to smd 15mil, copper to edge 40mil, drill to drill 8mil, minimum pad ring 10mil, minimum via ring 8mil, stop-mask expansion 4mil, vias tented up to drill 0mil, thermal gap 10mil
Milling: 4 lines

### Footprints (pad centres in the part's own frame; a part is rotated, then mirrored left to right if it is on the bottom)
CAP-SIZE_D/E_EIA7343 = smd 1.9 x 2.5: + -3.1,0; - 3.1,0
R-0805 = smd 0.762 x 1.27: A -1.016,0; B 1.016,0
AAVID_7106 = smd 2 x 8.2: L -6.825,3.575; R 6.825,3.575
CUI_RCJ-02X = drill 2 round: GND@1 -5.15,0; GND@2 5.15,0 | drill 1.7 round: PIN 0,1.6
2X14X0.100_HDR = drill 0.991 square: 1 -16.51,-1.27 | drill 0.991 round: 2 -16.51,1.27; 3 -13.97,-1.27; 4 -13.97,1.27; 5 -11.43,-1.27; 6 -11.43,1.27; 7 -8.89,-1.27; 8 -8.89,1.27; 9 -6.35,-1.27; 10 -6.35,1.27; 11 -3.81,-1.27; 12 -3.81,1.27; 13 -1.27,-1.27; 14 -1.27,1.27; 15 1.27,-1.27; 16 1.27,1.27; 17 3.81,-1.27; 18 3.81,1.27; 19 6.35,-1.27; 20 6.35,1.27; 21 8.89,-1.27; 22 8.89,1.27; 23 11.43,-1.27; 24 11.43,1.27; 25 13.97,-1.27; 26 13.97,1.27; 27 16.51,-1.27; 28 16.51,1.27
OST_SCREWTERM_3.5MM_2POS = drill 1.2 square: 1 -1.75,0; 2 1.75,0
PHOENIX_1844317 = drill 1.2 square: 1 -19.25,0 | drill 1.2 round: 2 -15.75,0; 3 -12.25,0; 4 -8.75,0; 5 -5.25,0; 6 -1.75,0; 7 1.75,0; 8 5.25,0; 9 8.75,0; 10 12.25,0; 11 15.75,0; 12 19.25,0
MTG-6-32 = drill 3.797 pad 6.35 round: 1 0,0
DD-7_LINEARTECH = smd 0.889 x 2.286: 1 -3.81,-6.35; 2 -2.54,-6.35; 3 -1.27,-6.35; 4 0,-6.35; 5 1.27,-6.35; 6 2.54,-6.35; 7 3.81,-6.35 | smd 10.668 x 8.89: PAD 0,3.048

### Placement (x,y rotation side)
C1  54.61,73.66 270 top
C2  66.04,81.28 0 top
C3  58.42,74.93 270 top
C4  66.04,76.2 0 top
C5  87.63,76.2 270 top
C6  83.82,74.93 90 top
C7  96.52,86.36 270 top
C8  92.71,85.09 90 top
C9  53.34,35.56 270 top
C10  66.04,46.99 0 top
C11  58.42,36.83 270 top
C12  64.77,41.91 0 top
C13  115.57,39.37 180 top
C14  114.3,33.02 0 top
C15  107.95,19.05 90 top
C16  101.6,19.05 270 top
C17  238.76,25.4 90 top
C18  262.89,22.86 90 top
C19  231.78,21.59 180 top
C20  257.81,22.86 90 top
C31  30.48,29.21 180 top
C32  66.04,6.35 0 top
C33  30.48,24.13 180 top
C34  64.77,11.43 0 top
C37  302.26,16.51 180 top
C38  300.99,11.43 0 top
C39  295.91,36.83 270 top
C40  290.83,36.83 90 top
C43  246.38,33.02 270 top
C44  262.89,53.34 90 top
C45  251.46,34.29 270 top
C46  267.97,52.07 90 top
C49  259.08,73.66 0 top
C50  241.3,76.2 270 top
C51  257.81,69.85 0 top
C52  236.22,77.47 270 top
C55  292.1,60.96 90 top
C56  295.91,62.23 270 top
C57  314.96,57.15 90 top
C58  318.77,58.42 270 top
HS1  52.07,87.63 0 top
HS2  100.33,59.69 0 top
HS3  45.72,52.07 0 top
HS4  95.25,35.56 180 top
HS5  248.92,13.97 180 top
HS6  44.45,7.62 0 top
HS7  306.07,21.59 0 top
HS8  242.57,46.99 0 top
HS9  252.75,84.95 0 top
HS10  304.8,67.31 0 top
J1  76.2,87.63 90 bottom
J2  76.2,68.58 90 bottom
J3  76.2,49.53 90 bottom
J4  76.2,30.48 90 bottom
J5  279.4,11.43 90 bottom
J6  127,87.63 90 bottom
J7  127,68.58 90 bottom
J8  127,49.53 90 bottom
J9  127,30.48 90 bottom
J10  330.2,11.43 90 bottom
J11  152.4,87.63 90 bottom
J12  152.4,68.58 90 bottom
J13  152.4,49.53 90 bottom
J14  152.4,30.48 90 bottom
J15  355.6,11.43 90 bottom
J16  177.8,87.63 90 bottom
J17  177.8,68.58 90 bottom
J18  177.8,49.53 90 bottom
J19  177.8,30.48 90 bottom
J20  381,11.43 90 bottom
J21  76.2,11.43 90 bottom
J22  127,11.43 90 bottom
J23  152.4,11.43 90 bottom
J24  177.8,11.43 90 bottom
J25  279.4,30.48 90 bottom
J26  330.2,30.48 90 bottom
J27  355.6,30.48 90 bottom
J28  381,30.48 90 bottom
J29  279.4,49.53 90 bottom
J30  330.2,49.53 90 bottom
J31  355.6,49.53 90 bottom
J32  381,49.53 90 bottom
J33  279.4,87.63 90 bottom
J34  330.2,87.63 90 bottom
J35  355.6,87.63 90 bottom
J36  381,87.63 90 bottom
J37  279.4,68.58 90 bottom
J38  330.2,68.58 90 bottom
J39  355.6,68.58 90 bottom
J40  381,68.58 90 bottom
J41  213.36,55.88 270 top
J42  394.14,68.25 90 top
J43  394.14,61.25 90 top
J44  394.14,54.25 90 top
J45  394.14,47.25 90 top
J46  19.25,68.25 270 top
J47  19.25,61.25 270 top
J48  19.25,54.25 270 top
J49  19.25,47.25 270 top
J50  19.25,40.25 270 top
J51  19.25,33.25 270 top
J52  394.14,40.25 90 top
J53  394.14,33.25 90 top
J54  19.25,50.75 270 top
J55  394.15,50.75 270 top
MH1  8.89,8.89 0 top
MH2  397.51,92.71 0 top
MH3  397.51,8.89 0 top
MH4  8.89,92.71 0 top
MH5  213.36,92.71 0 top
MH6  213.36,8.89 0 top
MH7  139.7,8.89 0 top
MH8  139.7,92.71 0 top
MH9  292.1,8.89 0 top
MH10  292.1,92.71 0 top
R1  48.26,77.47 180 top
R2  99.06,77.47 90 top
R3  41.91,41.91 180 top
R4  96.52,19.05 270 top
R5  252.73,24.13 0 top
R6  48.26,24.13 0 top
R7  304.8,39.37 90 top
R8  238.76,36.83 180 top
R9  248.92,74.93 180 top
R10  306.07,57.15 270 top
R11  50.8,73.66 270 top
R12  102.87,77.47 90 top
R13  44.45,40.64 270 top
R14  91.76,18.73 180 top
R15  250.19,26.67 90 top
R16  45.72,29.21 90 top
R17  308.61,39.37 90 top
R18  241.3,34.29 270 top
R19  251.46,71.12 270 top
R20  302.26,57.15 270 top
R21  62.23,74.3 270 top
R22  234.31,81.6 180 top
R23  90.17,85.09 90 top
R24  321.94,58.42 270 top
R25  65.09,52.7 0 top
R26  271.14,52.07 90 top
R27  113.03,18.41 270 top
R28  286.38,36.2 180 top
R29  64.77,14.61 0 top
R30  267.33,16.51 0 top
U1  52.07,87.63 0 top
U2  100.33,66.04 180 top
U3  45.72,52.07 0 top
U4  95.25,29.21 0 top
U5  248.92,13.97 180 top
U6  44.45,13.97 180 top
U7  306.07,29.21 180 top
U8  242.57,46.99 0 top
U9  252.75,84.95 0 top
U10  304.8,67.31 0 top

### Tracks (layer width: path | path; a pad name or v marks a point on that pad's centre or on a via)
+5V_A  (via drill 0.6)
  Top 0.813: v52.07,88.9 U1.4 U1.5 | J16.PIN 207.01,87.63 212.09,82.55 J41.1
  other vias: 48.26,93.98 48.26,91.44 48.26,88.9 55.88,88.9 55.88,91.44 55.88,93.98 52.07,93.98 52.07,91.44
  pour Route2: 30.48,96.52 186.69,96.52 186.69,80.01 30.48,80.01
  pour Top: 40.64,97.79 66.04,97.79 66.04,74.93 60.96,74.93 60.96,77.47 60.96,86.36 40.64,86.36
+5V_A_IMON
  Top 0.381: J41.3 205.74,69.85 198.12,77.47 124.46,77.47 120.65,81.28 120.65,91.44 115.57,96.52 76.2,96.52 72.39,92.71 72.39,68.58 69.85,66.04 46.99,66.04 45.72,67.31 45.72,73.66 46.74,74.68 R11.A
  Top 0.813: R11.A U1.3
+5V_B  (via drill 0.6)
  Top 0.813: v252.73,85.09 252.75,85.09 U9.4 252.73,78.6 252.73,76.2 254.02,76.2 U9.5 | J41.2 214.63,76.2 217.17,78.74 235.97,78.74 C52.A
  other vias: 256.54,90.17 256.54,87.63 256.54,85.09 252.73,87.63 252.73,90.17 248.92,90.17 248.92,87.63 248.92,85.09
  pour Route2: 233.68,99.06 404.5,99.06 404.5,78.74 233.68,78.74
  pour Top: 265.43,96.52 265.43,83.82 245.11,83.82 245.11,77.47 234.95,77.47 234.95,96.52
+5V_B_IMON
  Top 0.381: J41.4 236.22,69.85 237.49,68.58 242.57,68.58 246.38,72.39 251.21,72.39
  Top 0.406: R19.A 251.48,72.14
  Top 0.813: 251.48,72.14 U9.3 | 251.21,72.39 R19.A
+5V_IN  (via drill 0.6)  (1 unrouted)
  Top 0.813: C49.+ 255.29,73.66
  other vias: 55.24,84.14 57.78,84.14 58.74,81.28 256.54,81.28 259.08,81.28 261.62,81.28 261.62,78.74 259.08,78.74
  pour Route15: 13.97,65.35 13.97,99.06 401.32,99.06 401.32,65.41 391.16,65.41 391.16,77.47 254,77.47 254,88.9 222.25,88.9 222.25,80.01 23.86,80.01 23.86,65.35
  pour Top (no thermals): 54.29,85.09 59.69,85.09 59.69,76.2 59.69,74.93 52.07,74.93 52.07,78.74 54.29,78.74
  pour Top (no thermals): 254.95,82.55 262.89,82.55 262.89,77.47 257.81,77.47 257.81,68.58 254.95,68.58
+15V_A  (via drill 0.6)
  Top 0.813: v45.72,52.07 U3.4 U3.5 | J18.PIN 193.04,49.53 194.31,50.8 194.31,54.61 196.85,57.15 J41.13
  other vias: 41.91,52.07 49.53,52.07 49.53,54.61 49.53,57.15 45.72,57.15 45.72,54.61 41.91,54.61 41.91,57.15
  pour Route2: 30.48,58.42 186.69,58.42 186.69,40.64 30.48,40.64
  pour Top: 64.77,64.77 64.77,40.64 60.96,40.64 60.96,43.18 60.96,49.53 38.1,49.53 38.1,64.77
+15V_A_IMON
  Top 0.381: J41.15 198.12,54.61 196.85,53.34 196.85,49.53 194.31,46.99 83.82,46.99 68.58,31.75 57.15,31.75 54.61,34.29 48.26,34.29 46.99,35.56 46.99,40.64 45.97,41.66 R13.A
  Top 0.406: R13.A U3.3
+15V_B  (via drill 0.6)
  Top 0.813: v242.57,46.99 U8.4 242.57,38.1 243.84,38.1 U8.5 | J41.14 224.79,57.15 227.33,54.61 229.87,54.61 231.14,53.34 v238.76,53.34
  other vias: 238.76,46.99 238.76,50.16 242.57,53.34 246.38,53.34 246.38,50.16 242.57,50.16 246.38,46.99
  pour Route2: 233.68,58.42 404.5,58.42 404.5,40.64 233.68,40.64
  pour Top: 228.6,57.15 257.81,57.15 257.81,52.07 272.42,52.07 272.42,45.72 228.6,45.72
+15V_B_IMON
  Top 0.381: U8.3 241.3,43.18 240.03,44.45 226.06,44.45 224.79,45.72 224.79,52.07 222.25,54.61 J41.16
  Top 0.813: U8.3 R18.A
+15V_IN  (via drill 0.6)  (1 unrouted)
  Top 0.813: J41.23 203.84,44.45 200.66,41.27 v200.66,38.1
  Route2 0.813: v200.66,38.1 208.28,38.1 211.46,34.92 244.47,34.92 247.65,38.1 v250.19,38.1
  other vias: 250.19,43.18 252.73,43.18 255.27,43.18 255.27,40.64 252.73,40.64 250.19,40.64 246.38,43.18 52.07,46.99 54.61,46.99 57.15,46.99 57.15,44.45 54.61,44.45 52.07,44.45
  pour Top (no thermals): 244.79,44.45 256.54,44.45 256.54,34.29 243.84,34.29 243.84,36.83 244.79,36.83
  pour Route15: 13.97,51.32 13.97,57.19 38.5,57.19 38.5,59.69 384.81,59.69 384.81,55.88 401.32,55.88 401.32,50.8 374.01,50.8 374.01,36.83 251.46,36.83 251.46,29.21 215.9,29.21 215.9,43.18 44.45,43.18 44.45,51.32
  pour Top (no thermals): 47.94,48.58 47.94,43.18 50.8,43.18 50.8,36.83 59.69,36.83 59.69,42.55 59.69,48.58
+24V_A  (via drill 0.6)
  Top 0.813: v44.45,13.97 U6.4 U6.5 | J24.PIN 199.39,11.43 207.01,19.05 207.01,39.37 209.55,41.91 J41.25
  other vias: 48.26,7.62 48.26,10.79 48.26,13.97 40.64,13.97 40.64,10.79 40.64,7.62 44.45,7.62 44.45,10.79
  pour Route2: 186.69,2.54 30.48,2.54 30.48,20.32 186.69,20.32
  pour Top: 55.88,17.78 64.77,17.78 64.77,3.81 33.02,3.81 33.02,17.46 52.07,17.46
+24V_A_IMON
  Top 0.381: R16.A 45.97,27.94 59.69,27.94 68.58,19.05 78.74,19.05 82.55,15.24 82.55,10.16 88.9,3.81 201.93,3.81 212.09,13.97 J41.27
  Top 0.813: U6.3 R16.A
+24V_B  (via drill 0.6)
  Top 0.813: v248.92,13.97 U5.4 248.92,22.86 247.65,22.86 | 247.65,22.86 U5.5 | J41.26 217.17,41.91 218.44,40.64 218.44,24.13 219.71,22.86 223.52,22.86 226.06,25.4 247.65,25.4 247.65,22.86
  other vias: 248.92,10.79 248.92,7.62 245.11,13.97 245.11,10.79 245.11,7.62 252.73,7.62 252.73,10.79 252.73,13.97
  pour Route2: 233.68,20.32 404.5,20.32 404.5,2.54 233.68,2.54
  pour Top: 266.7,22.86 266.7,2.54 238.76,2.54 238.76,16.51 256.54,16.51 256.54,22.86
+24V_B_IMON  (via drill 0.6)
  Top 0.381: v214.63,17.78 J41.28
  Top 0.813: R15.A U5.3 250.19,18.1 v250.51,17.78
  Bottom 0.381: v250.51,17.78 v214.63,17.78
+24V_IN  (via drill 0.6)  (1 unrouted)
  other vias: 233.68,12.7 233.68,10.16 233.68,7.62 236.22,7.62 236.22,10.16 236.22,12.7 33.02,22.86 35.56,22.86 38.1,22.86 33.02,20.32 35.56,20.32 38.1,20.32
  pour Top (no thermals): 246.7,17.78 246.7,23.5 232.41,23.5 232.41,6.35 237.49,6.35 237.49,17.78
  pour Route15: 13.97,1.27 13.97,43.16 33.02,43.16 33.02,24.13 64.77,24.13 64.77,13.97 390.52,13.97 390.52,43.18 401.32,43.18 401.32,1.27
  pour Top (no thermals): 42.23,33.02 42.23,22.86 42.23,18.41 30.48,18.41 30.48,33.02
-5V_A  (via drill 0.6)
  Top 0.813: J17.PIN 200.66,68.58 204.47,64.77 J41.7
  other vias: 95.57,74.93 93.66,74.93 93.66,72.39 93.66,77.47 95.57,77.47
  pour Route2: 186.69,78.74 186.69,59.69 30.48,59.69 30.48,78.74
  pour Top (no thermals): 98.11,85.09 98.11,82.55 96.52,82.55 96.84,71.12 92.71,71.12 92.71,82.55 88.9,82.55 88.9,85.09
-5V_A_IMON
  Top 0.381: J41.9 194.31,62.23 191.77,59.69 123.19,59.69 119.38,63.5 119.38,73.66 116.59,76.45 R12.A
  Top 0.406: R12.A U2.2
-5V_B  (via drill 0.6)
  Top 0.813: J41.8 269.24,64.77 273.05,68.58 J37.PIN
  other vias: 323.85,64.77 323.85,62.23 321.31,62.23 321.31,64.77 318.77,64.77 318.77,62.23
  pour Route2: 233.68,77.47 404.5,77.47 404.5,59.69 233.68,59.69
  pour Top (no thermals): 308.29,62.23 317.5,62.23 317.5,66.04 325.12,66.04 325.12,58.42 308.29,58.42
-5V_B_IMON
  Top 0.381: J41.10 274.32,62.23 276.86,59.69 283.21,59.69 290.83,52.07 297.18,52.07 298.45,53.34 298.45,57.15 299.47,58.17 R20.A
  Top 0.813: R20.A U10.2
-5V_IN  (via drill 0.6)  (1 unrouted)
  Top 0.813: v104.14,66.04 U2.1 | U2.3 U2.4 v100.33,66.04
  other vias: 104.14,63.5 104.14,60.96 100.33,60.96 100.33,63.5 96.52,66.04 96.52,63.5 96.52,60.96 289.56,74.93 289.56,72.39 289.56,69.85 289.56,67.31 289.56,64.77
  pour Top: 113.03,55.88 113.03,68.58 91.44,68.58 91.44,74.93 81.28,74.93 81.28,55.88
  pour Top: 316.23,77.47 316.23,64.77 304.8,64.77 304.8,59.69 299.72,59.69 299.72,62.23 288.29,62.23 288.29,77.47
  pour Route15: 13.97,64.33 25.15,64.33 25.15,78.74 226.06,78.74 226.06,87.63 250.19,87.63 250.19,76.2 389.25,76.2 389.25,64.14 401.32,64.14 401.32,57.78 386.08,57.78 386.08,60.96 36.75,60.96 36.75,58.21 13.97,58.21
-15V_A  (via drill 0.6)
  Top 0.813: J19.PIN 191.77,30.48 195.58,34.29 195.58,44.45 200.66,49.53 J41.19
  other vias: 101.92,22.86 104.14,22.86 104.14,20.32
  pour Route2: 186.69,39.37 30.48,39.37 30.48,21.59 186.69,21.59
  pour Top (no thermals): 98.74,19.05 98.74,24.13 114.3,24.13 114.3,19.05
-15V_A_IMON
  Top 0.381: J41.21 201.93,46.99 198.12,43.18 198.12,31.75 194.31,27.94 173.99,27.94 166.37,20.32 121.92,20.32 118.11,16.51 118.11,11.43 115.57,8.89 93.98,8.89 92.77,10.1 R14.A
  Top 0.813: U4.2 92.77,22.8 R14.A
-15V_B  (via drill 0.6)
  Top 0.813: J41.20 220.98,49.53 222.25,48.26 222.25,45.72 226.06,41.91 226.06,34.29 227.33,33.02 v234.95,33.02
  other vias: 300.36,38.1 296.55,35.56 300.99,33.02 292.1,33.02 288.29,33.02 288.29,29.21 288.29,24.13 292.1,24.13 292.1,29.21
  pour Route2: 233.68,39.37 404.5,39.37 404.5,21.59 233.68,21.59
  pour Top (no thermals): 302.58,39.37 302.58,34.29 302.26,34.29 302.26,31.75 293.37,31.75 293.37,21.59 287.02,21.59 287.02,36.83 298.77,36.83 298.77,39.37
-15V_B_IMON  (via drill 0.6)
  Top 0.381: v284.48,41.91 287.02,44.45 311.15,44.45 312.42,43.18 312.42,39.37 311.4,38.35 R17.A
  Top 0.813: R17.A U7.2
  Bottom 0.381: J41.22 227.33,46.99 229.87,44.45 266.7,44.45 269.24,41.91 v284.48,41.91
-15V_IN  (via drill 0.6)  (1 unrouted)
  Top 0.813: J41.24 220.98,44.45 222.25,43.18 v222.25,25.4 | U4.4 v95.25,29.21 93.98,29.21 U4.3 | U4.1 v91.44,29.21
  other vias: 309.88,22.86 309.88,26.67 309.88,29.21 306.07,29.21 302.26,29.21 302.26,26.67 306.07,26.67 306.07,22.86 302.26,22.86 91.44,35.56 95.25,35.56 99.06,35.56 99.06,32.38 95.25,32.38 91.44,32.38 99.06,29.21
  pour Top: 114.3,26.67 82.55,26.67 82.55,41.91 114.3,41.91
  pour Top: 314.96,37.15 314.96,20.32 300.99,20.32 300.99,10.16 294.64,10.16 294.64,30.48 305.75,30.48 305.75,37.15
  pour Route15: 13.97,44.43 13.97,50.3 43,50.3 43,43.75 42.93,43.8 42.93,41.91 213.36,41.91 213.36,27.94 254,27.94 254,34.29 375.92,34.29 375.92,49.53 401.32,49.53 401.32,44.45 387.99,44.45 387.99,16.51 68.58,16.51 68.58,26.67 34.29,26.67 34.29,44.43
AGND  (via drill 0.6, 0.75)  (7 unrouted)
  Top 0.406: v39.37,41.91 R3.B | R13.B v44.45,38.1 | R16.B v45.72,31.75 | R6.B v50.8,24.13 | v96.52,16.51 R4.B | R14.B v88.9,18.73 | R12.B v102.87,80.01 | R2.B v99.06,80.01 | v97.79,69.85 U2.6
  Top 0.813: R11.B v50.8,71.12 | R9.B v246.38,74.93 | R19.B v251.46,68.58 | R5.B v255.27,24.13 | R15.B v250.19,29.21 | v303.53,33.02 U7.6 | R17.B v308.61,41.91 | R7.B v304.8,41.91 | v306.07,54.61 R10.B | v302.26,54.61 R20.B | C2.- v71.12,81.28 | C4.B v68.58,76.2 | v58.42,72.39 C3.B | C1.- v54.61,68.58 | R1.B v45.72,77.47 | C10.- v71.12,46.99 | C12.B v67.31,41.91 | v58.42,34.29 C11.B | C9.- v53.34,30.48 | C34.B v67.31,11.43 | C32.- v71.12,6.35 | C33.B v27.94,24.13 | C31.- v25.4,29.21 | C7.+ v96.52,91.44 | C8.B v92.71,87.63 | C5.+ v87.63,81.28 | C6.B v83.82,77.47 | C14.B v118.11,33.02 | C13.+ v121.92,39.37 | U4.6 v97.79,25.4 | v101.6,16.51 C16.B | v107.95,13.97 C15.+ | C49.- v264.16,73.66 | C51.B v260.35,69.85 | C50.- v241.3,71.12 | v236.22,74.93 C52.B | C46.B v267.97,54.61 | C44.- v262.89,58.42 | v251.46,31.75 C45.B | C43.- v246.38,27.94 | v241.3,31.75 R18.B | R8.B v236.22,36.83 | C20.B v257.81,25.4 | C18.- v262.89,27.94 | C17.- v238.76,31.75 | C19.B v229.24,21.59 | C40.B v290.83,39.37 | C39.+ v295.91,41.91 | C37.+ v307.34,16.51 | C38.B v303.53,11.43 | U10.6 v307.34,63.5 | v295.91,59.69 C56.B | C55.+ v292.1,55.88 | v314.96,52.07 C57.+ | C58.B v318.77,55.88 | R21.B v62.23,71.75 | R25.B v67.94,52.7 | R23.B v90.17,87.63 | R29.B v67.31,14.61 | R27.B v113.03,15.88 | R22.B v231.78,81.6 | R26.B v271.14,54.61 | R30.B v269.88,16.51 | v283.85,36.2 R28.B | R24.B v321.94,55.88
  pour Bottom: -0.64,99.69 404.5,99.69 405.13,0 0,0
N$1
  Top 0.406: U1.2 49.28,81.28 R1.A
N$2
  Top 0.406: U2.5 R2.A
N$3
  Top 0.381: U3.2 42.93,45.47 R3.A
N$4
  Top 0.406: R4.A U4.5
N$5
  Top 0.406: 251.46,24.13 R5.A
  Top 0.813: U5.2 251.46,24.13
N$10
  Top 0.406: 250.19,78.6 U9.2 | R9.A 250.19,74.93
  Top 0.813: 250.19,74.93 250.19,78.6
N$11
  Top 0.406: 46.99,24.13 R6.A
  Top 0.813: U6.2 46.99,24.13
N$14
  Top 0.813: U7.5 R7.A
N$16
  Top 0.406: R8.A 240.03,36.83
  Top 0.813: 240.03,36.83 U8.2
N$19
  Top 0.813: R10.A U10.5

### Text on the board
Top: 1
Route2: 2
Route15: 3
Bottom: 4
tPlace: +5VA | +5VB | GND | +5V | GND | +5V IN | GND | -5VA | -5VB | -5V | -5V IN | GND | GND | +15VA | +15VB | +15V | +15V IN | GND | GND | -15V | -15VA | -15VB | -15V IN | GND | -15V UNREG | -15V UNREG | GND | +24V | +24VB | +24V IN | +24VA | GND | SHLD | SHLD | SHLD | SHLD | POWER REGULATOR BREAKOUT | UWATERLOO/IQC ION TRAP GROUP | REV B / JUN 2018 (RWR) | S/N
tNames: POWER IN | POS INPUTS +1.5V ABOVE | VOLTAGE/CURRENT MONITOR | NEG INPUTS -1.5V BELOW | CURRENT MON: 1V/AMP | VOLTAGE MON: 1V/VOLT | V | V | I | I | GND | GND | V | V | I | I | GND | GND | V | V | I | I | GND | GND | V | V | I | I | V | V | I | I
tDocu: JMC-451612MSH | JAMES MONROE CABLE | 12x14AWG FESTOON CABLE